# EAGLE design 130617_ReceiverSTM_0_0 (EAGLE 6.1)
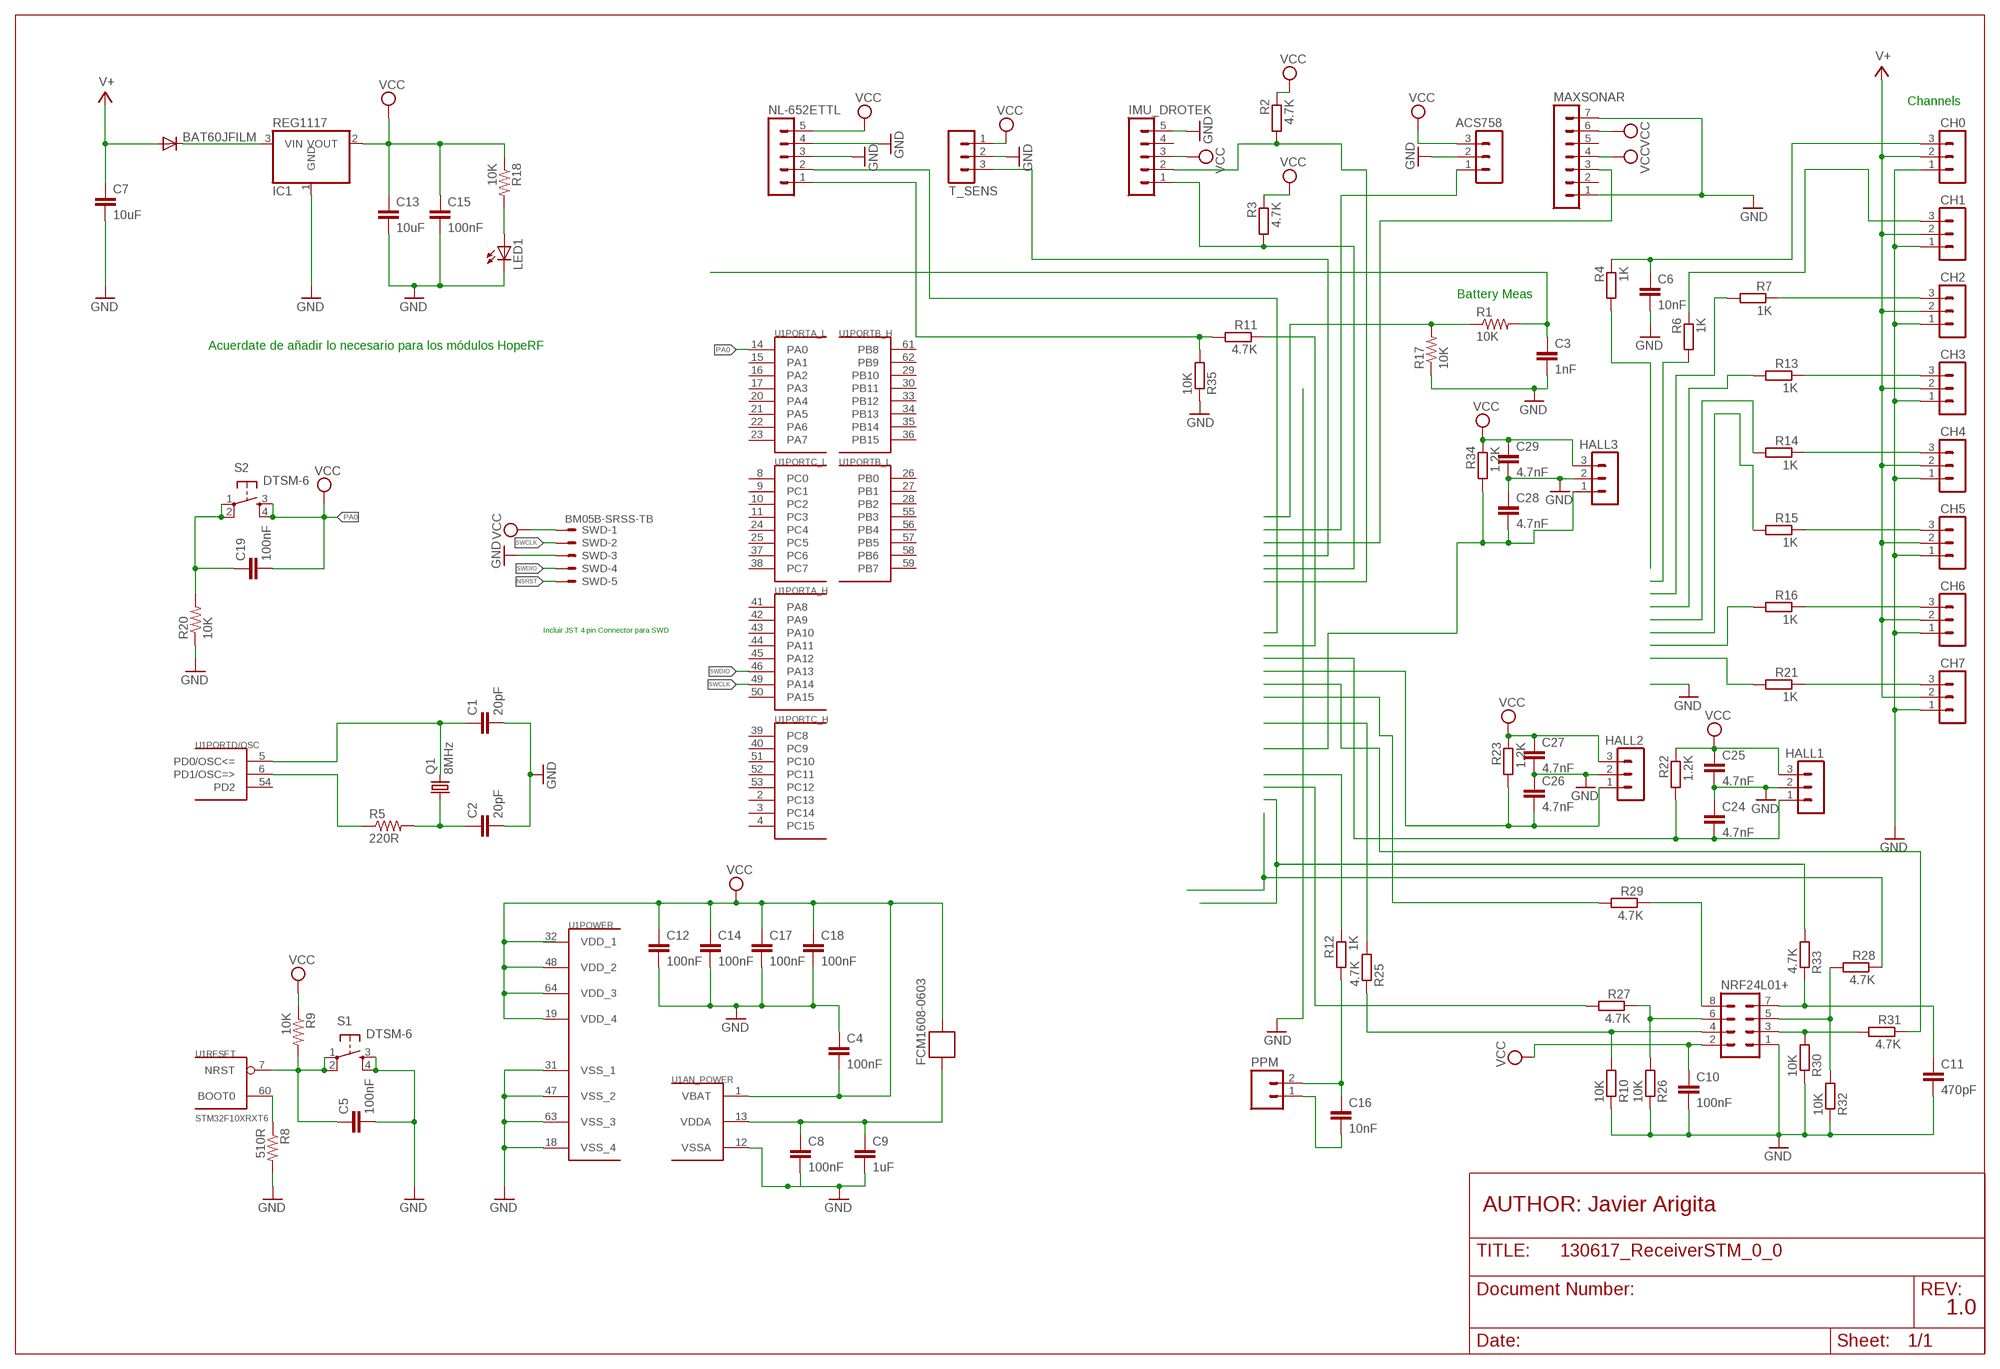
[diagram p0: schematic, sheet 1]

## Parts
ACS758  MA03-1  [MA03-1]
BAT60JFILM  DIODE-SOD323-R  [SOD323-R]
C1  20pF  C-EUC0805  [C0805]
C2  20pF  C-EUC0805  [C0805]
C3  1nF  C-EUC0805  [C0805]
C4  100nF  C-EUC0805  [C0805]
C5  100nF  C-EUC0805  [C0805]
C6  10nF  C-EU025-030X050  [C025-030X050]
C7  10uF  C-EUC3216  [C3216]
C8  100nF  C-EUC0805  [C0805]
C9  1uF  C-EUC3216  [C3216]
C10  100nF  C-EUC0805  [C0805]
C11  470pF  C-EU025-030X050  [C025-030X050]
C12  100nF  C-EUC0805  [C0805]
C13  10uF  C-EUC3216  [C3216]
C14  100nF  C-EUC0805  [C0805]
C15  100nF  C-EUC0805  [C0805]
C16  10nF  C-EU025-030X050  [C025-030X050]
C17  100nF  C-EUC0805  [C0805]
C18  100nF  C-EUC0805  [C0805]
C19  100nF  C-EUC0805  [C0805]
C24  4.7nF  C-EU025-030X050  [C025-030X050]
C25  4.7nF  C-EU025-030X050  [C025-030X050]
C26  4.7nF  C-EU025-030X050  [C025-030X050]
C27  4.7nF  C-EU025-030X050  [C025-030X050]
C28  4.7nF  C-EU025-030X050  [C025-030X050]
C29  4.7nF  C-EU025-030X050  [C025-030X050]
CH0  MA03-1  [MA03-1]
CH1  MA03-1  [MA03-1]
CH2  MA03-1  [MA03-1]
CH3  MA03-1  [MA03-1]
CH4  MA03-1  [MA03-1]
CH5  MA03-1  [MA03-1]
CH6  MA03-1  [MA03-1]
CH7  MA03-1  [MA03-1]
FCM1608-0603  FERRITE-BEAD  [R0603]
HALL1  MA03-1  [MA03-1]
HALL2  MA03-1  [MA03-1]
HALL3  MA03-1  [MA03-1]
IC1  REG1117  [SOT223]
IMU_DROTEK  MA05-1  [MA05-1]
LED1  LED0805  [CHIPLED_0805]
MAXSONAR  MA07-1  [MA07-1]
NL-652ETTL  MA05-1  [MA05-1]
NRF24L01+  MA04-2  [MA04-2]
PPM  M02  [02P]
Q1  8MHz  CRYSTALSM49  [SM49]
R1  10K  RESISTOR0805  [R0805]
R2  4.7K  R-EU_0204/7  [0204/7]
R3  4.7K  R-EU_0204/7  [0204/7]
R4  1K  R-EU_0204/7  [0204/7]
R5  220R  RESISTOR0805  [R0805]
R6  1K  R-EU_0204/7  [0204/7]
R7  1K  R-EU_0204/7  [0204/7]
R8  510R  RESISTOR0805  [R0805]
R9  10K  RESISTOR0805  [R0805]
R10  10K  R-EU_0204/7  [0204/7]
R11  4.7K  R-EU_0204/7  [0204/7]
R12  1K  R-EU_0204/7  [0204/7]
R13  1K  R-EU_0204/7  [0204/7]
R14  1K  R-EU_0204/7  [0204/7]
R15  1K  R-EU_0204/7  [0204/7]
R16  1K  R-EU_0204/7  [0204/7]
R17  10K  RESISTOR0805  [R0805]
R18  10K  RESISTOR0805  [R0805]
R20  10K  RESISTOR0805  [R0805]
R21  1K  R-EU_0204/7  [0204/7]
R22  1.2K  R-EU_0204/7  [0204/7]
R23  1.2K  R-EU_0204/7  [0204/7]
R25  4.7K  R-EU_0204/7  [0204/7]
R26  10K  R-EU_0204/7  [0204/7]
R27  4.7K  R-EU_0204/7  [0204/7]
R28  4.7K  R-EU_0204/7  [0204/7]
R29  4.7K  R-EU_0204/7  [0204/7]
R30  10K  R-EU_0204/7  [0204/7]
R31  4.7K  R-EU_0204/7  [0204/7]
R32  10K  R-EU_0204/7  [0204/7]
R33  4.7K  R-EU_0204/7  [0204/7]
R34  1.2K  R-EU_0204/7  [0204/7]
R35  10K  R-EU_0204/7  [0204/7]
S1  DTSM-6  [DTSM-6]
S2  DTSM-6  [DTSM-6]
SWD  BM05B-SRSS-TB  [BM05B-SRSS-TB]
T_SENS  MA03-1  [MA03-1]
U1  STM32F10XRXT6  [TQFP64]

## Nets
GND: ACS758.2 C1.2 C2.2 C3.2 C4.1 C5.2 C6.2 C7.2 C8.2 C9.2 C10.2 C11.2 C12.2 C13.2 C14.2 C15.2 C17.2 C18.2 C24.1 C25.2 C26.1 C27.2 C28.1 C29.2 CH0.1 CH1.1 CH2.1 CH3.1 CH4.1 CH5.1 CH6.1 CH7.1 HALL1.2 HALL2.2 HALL3.2 IC1.1(GND) IMU_DROTEK.5 LED1.C MAXSONAR.1 MAXSONAR.7 NL-652ETTL.3 NL-652ETTL.4 NRF24L01+.1 R8.2 R10.1 R17.1 R20.1 R26.1 R30.1 R32.1 R35.1 S1.3 S1.4 T_SENS.2 U1.12(AN_POWER:VSSA) U1.18(POWER:VSS_4) U1.31(POWER:VSS_1) U1.47(POWER:VSS_2) U1.63(POWER:VSS_3)
MAX_BRIDGE: NL-652ETTL.2
N$1: C1.1 Q1.2 U1.5(PORTD/OSC:PD0/OSC<=)
N$2: R5.1 U1.6(PORTD/OSC:PD1/OSC=>)
N$3: C2.1 Q1.1 R5.2
N$4: R8.1 U1.60(RESET:BOOT0)
N$5: C19.1 R20.2 S2.1 S2.2
N$6: ACS758.3 C25.1 C27.1 C29.1 HALL1.3 HALL2.3 HALL3.3 IMU_DROTEK.3 MAXSONAR.4 MAXSONAR.6 NL-652ETTL.5 R2.1 R3.1 R22.1 R23.1 R34.1 T_SENS.1 ; supply symbol labelled VCC
N$7: C16.2 PPM.1
N$8: IMU_DROTEK.2 R2.2
N$9: C5.1 R9.2 S1.1 S1.2 U1.7(RESET:NRST)
N$10: LED1.A R18.2
N$11: C28.2 HALL3.1 R34.2
N$12: R11.1
N$13: BAT60JFILM.C IC1.3(VIN)
N$14: C24.2 HALL1.1 R22.2
N$15: R12.1
N$16: C3.1 R1.2
N$17: C8.1 C9.1 FCM1608-0603.2 U1.13(AN_POWER:VDDA)
N$18: NRF24L01+.4 R10.2 R25.1
N$19: NRF24L01+.3 R30.2 R31.2
N$20: C16.1 PPM.2 R12.2
N$22: NL-652ETTL.1 R11.2 R35.2
N$25: T_SENS.3
N$26: R25.2
N$27: IMU_DROTEK.1 R3.2
N$28: ACS758.1
N$29: MAXSONAR.3
N$30: C26.2 HALL2.1 R23.2
N$33: R1.1 R17.2
N$37: R28.1
N$40: R33.2
N$41: R27.2
N$42: NRF24L01+.8 R29.1
N$43: NRF24L01+.6 R26.2 R27.1
N$46: R31.1
N$47: NRF24L01+.5 R28.2 R32.2
N$49: C11.1 NRF24L01+.7 R33.1
N$50: C6.1 CH0.3 R4.1
N$51: R4.2
N$52: R6.2
N$53: CH1.3 R6.1
N$54: CH2.3 R7.1
N$55: R7.2
N$56: CH3.3 R13.1
N$57: R13.2
N$58: CH4.3 R14.1
N$59: R14.2
N$60: CH5.3 R15.1
N$61: R15.2
N$62: CH6.3 R16.1
N$63: R16.2
N$64: CH7.3 R21.1
N$65: R21.2
N$66: R29.2
NSRST: SWD.5
PA0: C4.2 C10.1 C12.1 C13.1 C14.1 C15.1 C17.1 C18.1 C19.2 FCM1608-0603.1 IC1.2(VOUT) NRF24L01+.2 R9.1 R18.1 S2.3 S2.4 U1.1(AN_POWER:VBAT) U1.14(PORTA_L:PA0) U1.19(POWER:VDD_4) U1.48(POWER:VDD_2) U1.64(POWER:VDD_3) ; supply symbol labelled VCC
SWCLK: SWD.2 SWD.3 U1.49(PORTA_H:PA14) ; supply symbol labelled GND
SWDIO: SWD.4 U1.46(PORTA_H:PA13)
V+: BAT60JFILM.A C7.1 CH0.2 CH1.2 CH2.2 CH3.2 CH4.2 CH5.2 CH6.2 CH7.2
VCC: SWD.1
Unconnected: IMU_DROTEK.4 MAXSONAR.2 MAXSONAR.5 U1.2(PORTC_H:PC13) U1.3(PORTC_H:PC14) U1.4(PORTC_H:PC15) U1.8(PORTC_L:PC0) U1.9(PORTC_L:PC1) U1.10(PORTC_L:PC2) U1.11(PORTC_L:PC3) U1.15(PORTA_L:PA1) U1.16(PORTA_L:PA2) U1.17(PORTA_L:PA3) U1.20(PORTA_L:PA4) U1.21(PORTA_L:PA5) U1.22(PORTA_L:PA6) U1.23(PORTA_L:PA7) U1.24(PORTC_L:PC4) U1.25(PORTC_L:PC5) U1.26(PORTB_L:PB0) U1.27(PORTB_L:PB1) U1.28(PORTB_L:PB2) U1.29(PORTB_H:PB10) U1.30(PORTB_H:PB11) U1.33(PORTB_H:PB12) U1.34(PORTB_H:PB13) U1.35(PORTB_H:PB14) U1.36(PORTB_H:PB15) U1.37(PORTC_L:PC6) U1.38(PORTC_L:PC7) U1.39(PORTC_H:PC8) U1.40(PORTC_H:PC9) U1.41(PORTA_H:PA8) U1.42(PORTA_H:PA9) U1.43(PORTA_H:PA10) U1.44(PORTA_H:PA11) U1.45(PORTA_H:PA12) U1.50(PORTA_H:PA15) U1.51(PORTC_H:PC10) U1.52(PORTC_H:PC11) U1.53(PORTC_H:PC12) U1.54(PORTD/OSC:PD2) U1.55(PORTB_L:PB3) U1.56(PORTB_L:PB4) U1.57(PORTB_L:PB5) U1.58(PORTB_L:PB6) U1.59(PORTB_L:PB7) U1.61(PORTB_H:PB8) U1.62(PORTB_H:PB9)

## Notes on the sheet
- Channels
- Battery Meas
- Acuerdate de añadir lo necesario para los módulos HopeRF
- Incluir JST 4 pin Connector para SWD
- AUTHOR: Javier Arigita
- 1.0

## Power pins joined to a net without a drawn wire
VDD_1: U1.32(POWER:VDD_1)

## Library data of the parts
ACS758 CH0 CH1-CH7 HALL1-HALL3 T_SENS = con-lstb:MA03-1: PIN HEADER; OC_FARNELL: unknown; OC_NEWARK: unknown
BAT60JFILM = diode:DIODE-: DIODE
C1-C6 C8 C10-C12 C14-C19 C24-C29 = rcl:C-EU: CAPACITOR, European symbol
C7 C9 C13 = resistor:C-EU: CAPACITOR, European symbol
FCM1608-0603 = BaseApp:FERRITE-BEAD
IC1 = CEDT:REG1117: 800mA and 1A Low Dropout (LDO) Positive Regulator 1.8V, 2.5V, 2.85V, 3.3V, 5V, and Adj
IMU_DROTEK NL-652ETTL = con-lstb:MA05-1: PIN HEADER; OC_FARNELL: unknown; OC_NEWARK: unknown
LED1 = CEDT:LED
MAXSONAR = con-lstb:MA07-1: PIN HEADER; OC_FARNELL: unknown; OC_NEWARK: unknown
NRF24L01+ = con-lstb:MA04-2: PIN HEADER; OC_FARNELL: unknown; OC_NEWARK: unknown
PPM = con-amp-quick:M02: AMP QUICK CONNECTOR; OC_FARNELL: unknown; OC_NEWARK: unknown
Q1 = crystal:CRYSTAL: CRYSTAL; OC_FARNELL: unknown; OC_NEWARK: unknown
R1 R5 R8 R9 R17 R18 R20 = CEDT:RESISTOR
R2-R4 R6 R7 R10-R16 R21-R23 R25-R35 = rcl:R-EU_: RESISTOR, European symbol
S1 S2 = switch-tact:DTSM-6
SWD = con-jst2:?M05B-SRSS-TB: Disconnectable Crimp style connector, 1.0mm pitch 5 contacts
U1 = stm32:STM32F10XRXT6: STM32F101/103 64pin LQFP

## Board
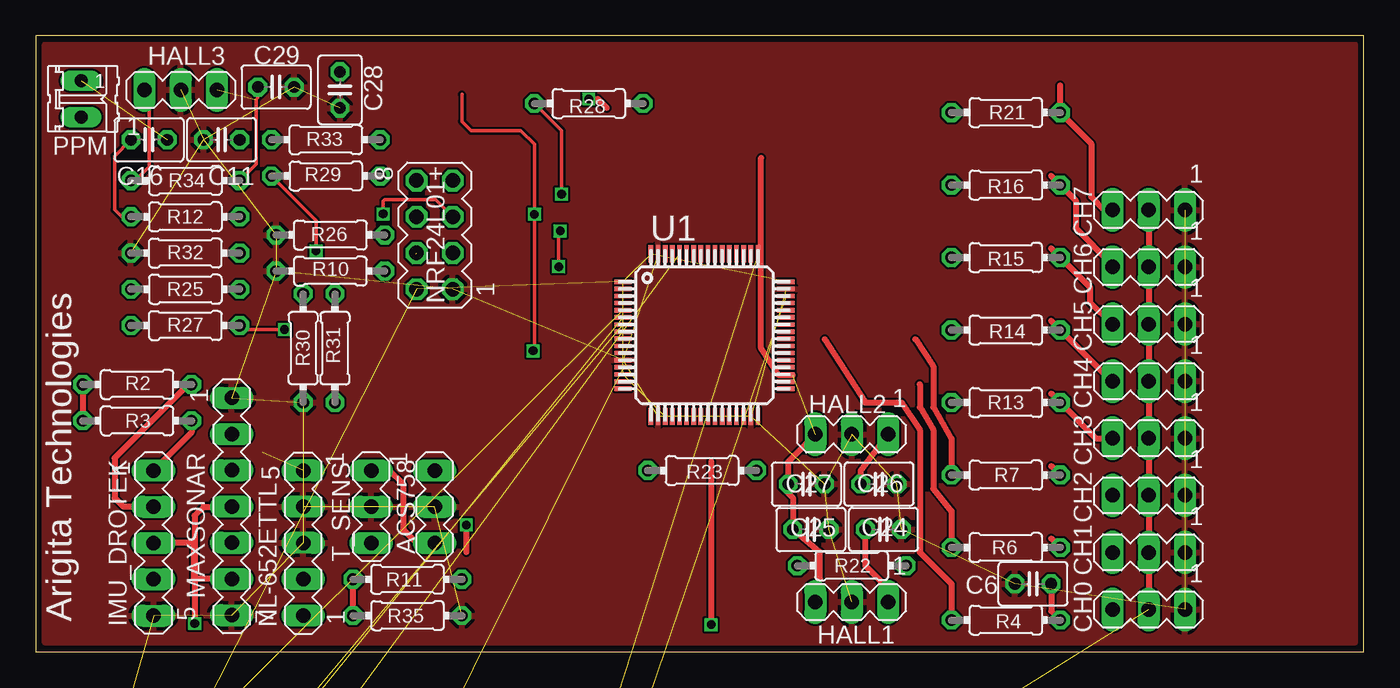
[diagram p1: board, top side]
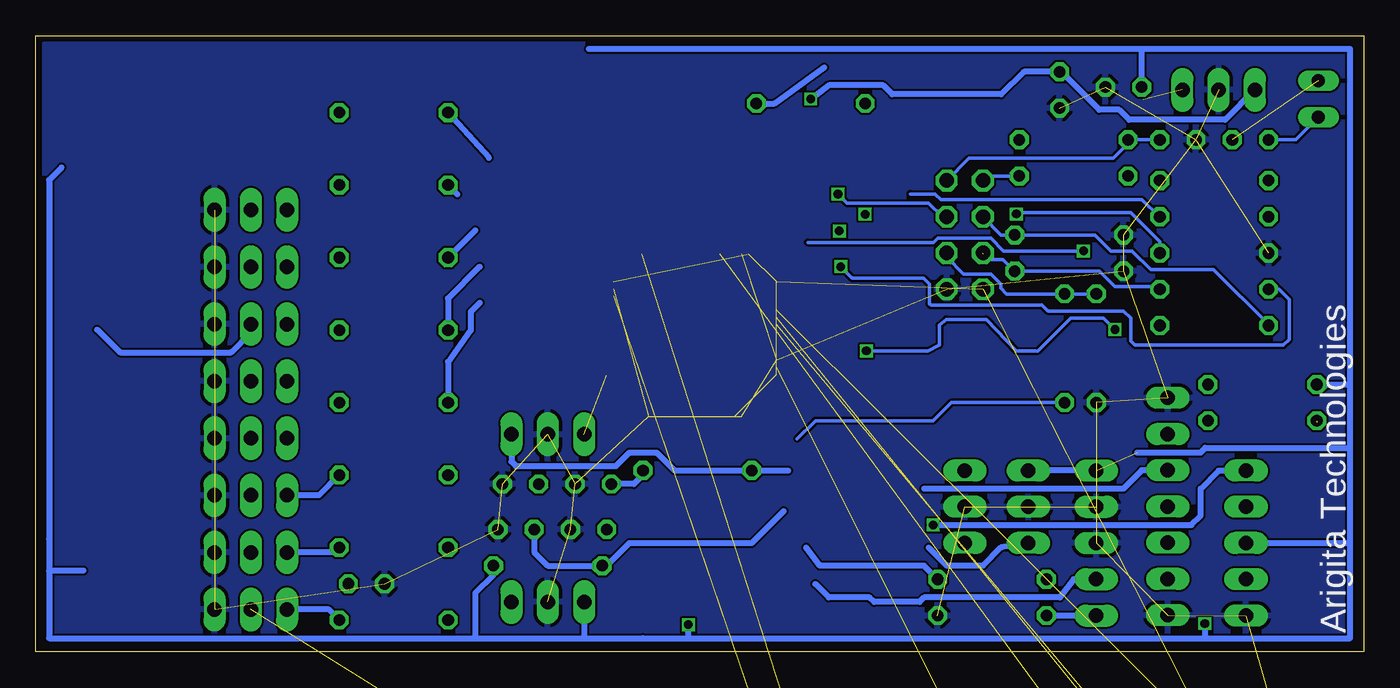
[diagram p2: board, bottom side, seen from below]

Size 93.02 x 43.17 mm. Coordinates in mm from the lower left corner, seen from the top.
Outline: 0,0 93.02,0 93.02,43.17 0,43.17 0,0
Copper layers (1*16): Top 0.035mm / dielectric 1.5mm / Bottom 0.035mm
Design rules: minimum track width 6mil, minimum drill 12mil, track to track 6mil, track to pad 6mil, pad to pad 6mil, via to via 6mil, smd to smd 0mil, copper to edge 10mil, drill to drill 10mil, minimum pad ring 10mil, minimum via ring 6mil, stop-mask expansion 2mil, vias tented up to drill 100mil, thermal gap 10mil

### Footprints (pad centres in the part's own frame; a part is rotated, then mirrored left to right if it is on the bottom)
MA03-1 = drill 1.016 long: 1 -2.54,0; 2 0,0; 3 2.54,0
SOD323-R = smd 0.6 x 0.6: A 1.1,0; C -1.1,0
C0805 = smd 1.3 x 1.5: 1 -0.95,0; 2 0.95,0
C025-030X050 = drill 0.813 octagon: 1 -1.27,0; 2 1.27,0
C3216 = smd 1.6 x 1.8: 1 -1.4,0; 2 1.4,0
R0603 = smd 1 x 1.1: 1 -0.85,0; 2 0.85,0
SOT223 = smd 1.499 x 2.007: 1 -2.261,-3.15; 2 0.025,-3.15; 3 2.311,-3.15 | smd 3.81 x 2.007: 4 0,3.15
MA05-1 = drill 1.016 long: 1 -5.08,0; 2 -2.54,0; 3 0,0; 4 2.54,0; 5 5.08,0
CHIPLED_0805 = smd 1.2 x 1.2: A 0,-1.05; C 0,1.05
MA07-1 = drill 1.016 long: 1 -7.62,0; 2 -5.08,0; 3 -2.54,0; 4 0,0; 5 2.54,0; 6 5.08,0; 7 7.62,0
MA04-2 = drill 1.016 octagon: 1 -3.81,-1.27; 2 -3.81,1.27; 3 -1.27,-1.27; 4 -1.27,1.27; 5 1.27,-1.27; 6 1.27,1.27; 7 3.81,-1.27; 8 3.81,1.27
02P = drill 0.914 long: 1 -1.27,0; 2 1.27,0
SM49 = smd 5.08 x 1.778: 1 -4.826,0; 2 4.826,0
R0805 = smd 1.3 x 1.5: 1 -0.95,0; 2 0.95,0
0204/7 = drill 0.813 octagon: 1 -3.81,0; 2 3.81,0
DTSM-6 = smd 1.55 x 1.3: 1 -3.975,2.25; 2 3.975,2.25; 3 -3.975,-2.25; 4 3.975,-2.25
BM05B-SRSS-TB = smd 0.6 x 1.55: 1 2,-1.625; 2 1,-1.625; 3 0,-1.625; 4 -1,-1.625; 5 -2,-1.625 | smd 1.2 x 1.8: FIT@1 3.3,0.9; FIT@2 -3.3,0.9
TQFP64 = smd 1.2 x 0.3: 1 -5.7,3.75; 2 -5.7,3.25; 3 -5.7,2.75; 4 -5.7,2.25; 5 -5.7,1.75; 6 -5.7,1.25; 7 -5.7,0.75; 8 -5.7,0.25; 9 -5.7,-0.25; 10 -5.7,-0.75; 11 -5.7,-1.25; 12 -5.7,-1.75; 13 -5.7,-2.25; 14 -5.7,-2.75; 15 -5.7,-3.25; 16 -5.7,-3.75; 33 5.7,-3.75; 34 5.7,-3.25; 35 5.7,-2.75; 36 5.7,-2.25; 37 5.7,-1.75; 38 5.7,-1.25; 39 5.7,-0.75; 40 5.7,-0.25; 41 5.7,0.25; 42 5.7,0.75; 43 5.7,1.25; 44 5.7,1.75; 45 5.7,2.25; 46 5.7,2.75; 47 5.7,3.25; 48 5.7,3.75 | smd 0.3 x 1.2: 17 -3.75,-5.7; 18 -3.25,-5.7; 19 -2.75,-5.7; 20 -2.25,-5.7; 21 -1.75,-5.7; 22 -1.25,-5.7; 23 -0.75,-5.7; 24 -0.25,-5.7; 25 0.25,-5.7; 26 0.75,-5.7; 27 1.25,-5.7; 28 1.75,-5.7; 29 2.25,-5.7; 30 2.75,-5.7; 31 3.25,-5.7; 32 3.75,-5.7; 49 3.75,5.7; 50 3.25,5.7; 51 2.75,5.7; 52 2.25,5.7; 53 1.75,5.7; 54 1.25,5.7; 55 0.75,5.7; 56 0.25,5.7; 57 -0.25,5.7; 58 -0.75,5.7; 59 -1.25,5.7; 60 -1.75,5.7; 61 -2.25,5.7; 62 -2.75,5.7; 63 -3.25,5.7; 64 -3.75,5.7

### Placement (x,y rotation side)
ACS758  27.94,10.16 270 top
BAT60JFILM  -16.07,-73.82 0 top  (outside the outline)
C1  2.03,-15.92 0 top  (outside the outline)
C2  2.03,-19.92 0 top  (outside the outline)
C3  -15.77,-90.02 0 top  (outside the outline)
C4  -21.77,-141.82 0 top  (outside the outline)
C5  -7.77,-38.22 0 top  (outside the outline)
C6  69.85,4.76 180 top
C7  -15.27,-56.02 0 top  (outside the outline)
C8  -15.77,-96.12 0 top  (outside the outline)
C9  -15.27,-102.02 0 top  (outside the outline)
C10  -15.77,-68.02 0 top  (outside the outline)
C11  13.02,35.88 180 top
C12  -15.77,-111.32 0 top  (outside the outline)
C13  -15.27,-50.22 0 top  (outside the outline)
C14  -15.77,-117.42 0 top  (outside the outline)
C15  -15.77,-61.92 0 top  (outside the outline)
C16  7.94,35.88 0 top
C17  -15.77,-123.52 0 top  (outside the outline)
C18  -15.77,-129.62 0 top  (outside the outline)
C19  -21.77,-168.02 0 top  (outside the outline)
C24  59.37,8.57 180 top
C25  54.29,8.57 0 top
C26  59.05,11.75 180 top
C27  53.97,11.75 0 top
C28  21.31,39.37 90 top
C29  16.83,39.57 0 top
CH0  77.95,2.96 180 top
CH1  77.95,6.96 180 top
CH2  77.95,10.96 180 top
CH3  77.95,14.96 180 top
CH4  77.95,18.96 180 top
CH5  77.95,22.96 180 top
CH6  77.95,26.96 180 top
CH7  77.95,30.96 180 top
FCM1608-0603  -15.97,-107.32 0 top  (outside the outline)
HALL1  57.15,3.49 180 top
HALL2  57.15,15.24 180 top
HALL3  10.16,39.37 0 top
IC1  -14.47,-40.92 0 top  (outside the outline)
IMU_DROTEK  8.25,7.62 270 top
LED1  -20.87,-130.82 0 top  (outside the outline)
MAXSONAR  13.73,10.18 270 top
NL-652ETTL  18.73,7.62 90 top
NRF24L01+  27.94,29.21 90 top
PPM  3.17,38.73 270 top
Q1  -16.37,-149.32 0 top  (outside the outline)
R1  -15.77,-77.82 0 top  (outside the outline)
R2  7.1,18.73 0 top
R3  7.1,16.19 0 top
R4  67.94,2.22 180 top
R5  2.03,-26.02 0 top  (outside the outline)
R6  67.94,7.3 180 top
R7  67.94,12.38 180 top
R8  2.03,-32.12 0 top  (outside the outline)
R9  -7.77,-44.32 0 top  (outside the outline)
R10  20.64,26.67 0 top
R11  26.04,5.08 180 top
R12  10.48,30.48 180 top
R13  67.94,17.46 180 top
R14  67.94,22.54 180 top
R15  67.94,27.62 180 top
R16  67.94,32.7 180 top
R17  -15.77,-83.92 0 top  (outside the outline)
R18  -21.77,-135.72 0 top  (outside the outline)
R20  -21.77,-174.12 0 top  (outside the outline)
R21  67.94,37.78 180 top
R22  57.15,6.03 180 top
R23  46.67,12.7 180 top
R25  10.48,25.4 180 top
R26  20.64,29.21 0 top
R27  10.48,22.86 0 top
R28  38.73,38.42 180 top
R29  20.32,33.34 180 top
R30  18.73,21.27 90 top
R31  20.95,21.27 90 top
R32  10.48,27.94 0 top
R33  20.32,35.88 0 top
R34  10.48,33.02 180 top
R35  26.04,2.54 180 top
S1  -4.97,-29.52 0 top  (outside the outline)
S2  -18.97,-159.42 0 top  (outside the outline)
SWD  -16.97,-179.62 0 top  (outside the outline)
T_SENS  23.5,10.16 270 top
U1  46.83,22.18 0 top

### Tracks (layer width: path | path; a pad name or v marks a point on that pad's centre or on a via)
GND  (58 unrouted)
  pour Top: 0.63,42.54 92.39,42.54 92.39,0.64 0.63,0.64
  pour Bottom: 0.63,42.54 92.39,42.54 92.39,0.64 0.63,0.64
MAX_BRIDGE
  Bottom 0.406: NL-652ETTL.2 20.32,5.08 21.27,3.81 30.8,3.81 31.11,3.49 34.29,3.49 34.61,3.81 37.47,3.81 38.42,4.76
N$1  (2 unrouted)
N$2  (1 unrouted)
N$3  (2 unrouted)
N$4  (1 unrouted)
N$5  (3 unrouted)
N$6  (via drill 0.6)  (4 unrouted)
  Top 0.254: R34.1 15.43,34.17 15.43,38.68 15.56,38.81 C29.1
  Top 0.406: 53.02,19.37 52.07,19.37 50.8,21.27 50.8,34.61 | HALL1.3 54.61,4.76 54.93,5.08 54.93,6.99 C25.1 53.02,10.8 52.71,11.11 C27.1 52.71,13.33 HALL2.3 | T_SENS.1 24.77,12.7 25.72,11.75 25.72,8.57 26.67,7.62 ACS758.3 | 47.31,13.33 v47.31,1.91 | MAXSONAR.4 13.73,10.16 11.75,10.16 11.11,9.52 11.13,9.52 v11.13,1.98 | MAXSONAR.6 11.11,5.1 11.11,7.62 IMU_DROTEK.3 | R2.1 3.29,16.08 3.33,16.08
  Bottom 0.406: 92.08,5.68 92.08,7.94 92.08,33.06 91.21,33.92 | 92.08,5.68 92.08,0.95 62.23,0.95 | 62.23,0.95 54.61,0.95 | 54.61,0.95 50.48,0.95 47.31,0.95 | 47.31,0.95 11.13,0.95 | 11.13,0.95 0.95,0.95 0.95,7.62 | 0.95,7.62 0.95,14.29 | 0.95,14.29 0.95,18.68 | 0.95,18.68 0.95,42.23 15.56,42.23 | 15.56,42.23 26.04,42.23 54.29,42.23 | 89.68,5.68 92.08,5.68 | 0.95,14.29 11.11,14.29 11.43,13.97 15.88,13.97 | HALL1.3 54.61,0.95 | R22.1 60.96,5.4 62.23,4.13 62.23,0.95 | R23.1 50.48,12.38 51.12,11.75 C27.1 | 47.31,0.95 v47.31,1.91 | NL-652ETTL.5 T_SENS.1 | IMU_DROTEK.3 0.95,7.62 | C29.1 15.56,42.23 | R2.1 1,18.73 0.95,18.68 | v11.13,1.98 11.13,0.95
N$7  (1 unrouted)
N$8
  Top 0.406: R2.2 10.68,18.73 5.53,13.58 5.53,10.78 6.13,10.18 8.23,10.18 IMU_DROTEK.2
N$9  (4 unrouted)
N$10  (1 unrouted)
N$11  (via drill 0.6)
  Top 0.254: HALL3.1 7.93,39.06 7.93,33.98 6.97,33.02 R34.2
  Top 0.406: v38.74,38.74 39.37,38.74 40,38.1
  Bottom 0.406: v38.74,38.74 37.47,39.69 33.65,39.69 33.02,39.05 25.4,39.05 23.81,40.64 C28.2 21.19,40.64 18.53,37.98 17.13,37.98 16.43,37.28 9.71,37.28 HALL3.1
N$12
  Bottom 0.406: R11.1 30.8,6.03 38.1,6.03 39.05,7.3
N$13  (1 unrouted)
N$14
  Top 0.406: HALL1.1 59.69,4.45 58.1,6.03 C24.2
  Bottom 0.406: C24.2 58.1,6.99 57.15,6.03 R22.2 53.02,6.03 51.43,7.62 42.86,7.62 40.64,9.84
N$15
  Bottom 0.254: 31.76,32.08 30.03,32.08 29.63,31.68 15.53,31.68 14.33,30.48 R12.1
N$16  (1 unrouted)
N$17  (3 unrouted)
N$18  (1 unrouted)
  Bottom 0.254: 26.63,27.88 26.43,27.88 26.03,27.48 25.26,27.48 R10.2 18.52,26.67 17.43,25.58 14.47,25.58 R25.1
N$19
  Bottom 0.254: R30.2 R31.2 25.03,25.08 25.43,25.48 25.43,25.78 26.13,26.48 28.03,26.48 29.21,27.66 NRF24L01+.3
N$20
  Top 0.254: C16.1 5.53,34.74 5.53,30.98 6.04,30.48 R12.2
  Bottom 0.254: PPM.2 4.76,35.88 C16.1
N$22
  Top 0.406: R35.2 R11.2
  Bottom 0.406: NL-652ETTL.1 R35.2
N$25
  Bottom 0.406: T_SENS.3 25.4,7.3 26.67,6.03 29.21,6.03 30.48,7.3
N$26  (via drill 0.6)
  Top 0.254: v36.73,29.48 36.63,29.38 v36.63,26.98
  Bottom 0.254: 36.79,29.48 v36.73,29.48 | v36.63,26.98 35.83,26.18 30.83,26.18 30.43,25.78 30.43,24.38 30.33,24.28 22.53,24.28 22.13,23.88 16.83,23.88 16.33,23.38 16.33,21.78 16.03,21.48 5.63,21.48 5.23,21.88 5.23,24.68 5.95,25.4 R25.2
N$27  (via drill 0.6)
  Top 0.406: 30.16,6.99 v30.16,8.89 | R3.2 10.91,15.36 IMU_DROTEK.1
  Bottom 0.406: v30.16,8.89 12.07,8.89 11.43,9.52 11.43,11.43 10.16,12.7 IMU_DROTEK.1
N$29
  Bottom 0.406: 30.8,11.43 16.83,11.43 15.56,12.7 15.56,12.72 MAXSONAR.3
N$30
  Top 0.406: C26.2 57.79,12.7 HALL2.1
  Bottom 0.406: HALL2.1 59.69,13.33 59.37,13.02 52.39,13.02 51.43,13.97 49.53,13.97 48.26,12.7 R23.2 40.32,12.7
N$33  (1 unrouted)
N$37
  Bottom 0.406: R28.1 41.28,38.42 37.78,40.96
N$41  (via drill 0.6)
  Top 0.254: 29.85,39.05 29.85,37.15 30.48,36.51 33.97,36.51 34.93,35.56 v34.93,30.66 34.93,21.17 v34.83,21.08 | R27.2 14.57,22.58 v17.43,22.58
  Bottom 0.254: v17.43,22.58 18.23,23.38 20.53,23.38 22.83,21.08 24.33,21.08 26.43,23.28 29.23,23.28 29.73,22.88 29.73,21.48 30.53,21.08 v34.83,21.08
N$42
  Bottom 0.254: NRF24L01+.8 26.35,33.34 R29.1
N$43
  Bottom 0.254: NRF24L01+.6 25.4,29.21 R26.2 24.42,29.18 18.83,29.18 17.73,28.08 16.23,28.08 14.93,26.78 10.53,26.78 6.67,22.92 R27.1
N$46
  Bottom 0.254: R31.1 28.89,17.46 30.16,16.19 38.42,16.19 39.69,14.92
N$47  (via drill 0.6)
  Top 0.254: R28.2 36.83,36.51 v36.83,32.07 | NRF24L01+.5 28.01,31.68 24.43,31.68 24.33,31.58 v24.33,30.68
  Bottom 0.254: 29.53,30.48 30.48,31.43 36.19,31.43 v36.83,32.07 | v24.33,30.68 24.23,30.78 16.33,30.78 14.29,28.74 R32.2
  Bottom 0.406: 29.53,30.48 NRF24L01+.5
N$49
  Bottom 0.254: NRF24L01+.7 27.65,34.58 17.53,34.58 16.51,35.6 R33.1 C11.1
N$50
  Top 0.406: C6.1 71.12,2.86 R4.1
  Bottom 0.406: R4.1 72.49,2.96 CH0.3
N$51
  Top 0.406: 55.25,21.91 58.1,17.46 60.64,17.46 61.91,15.56 61.91,6.99 64.13,4.76 R4.2
N$52
  Top 0.406: 61.91,18.73 61.91,17.14 62.86,15.56 62.86,11.43 64.13,9.84 R6.2
N$53
  Top 0.406: 71.12,7.94 R6.1
  Bottom 0.406: R6.1 72.1,6.96 CH1.3
N$54
  Top 0.406: 71.12,13.02 R7.1
  Bottom 0.406: R7.1 73.18,10.96 CH2.3
N$55
  Top 0.406: 61.6,21.91 62.86,20 62.86,17.14 64.13,14.92 R7.2
N$56
  Top 0.406: 71.12,18.1 R13.1 74.25,14.96 CH3.3
N$57
  Bottom 0.406: 61.91,24.45 62.55,23.81 62.55,22.54 64.13,20.32 R13.2
N$58
  Top 0.406: 71.12,23.18 R14.1 75.33,18.96 CH4.3
N$59
  Bottom 0.406: 61.91,26.99 64.13,24.76 R14.2
N$60
  Top 0.406: 71.12,28.26 R15.1 73.83,25.55 73.83,24.48 75.35,22.96 CH5.3
N$61
  Bottom 0.406: 62.23,29.53 R15.2
N$62
  Top 0.406: 71.12,33.34 R16.1 72.83,31.62 72.83,29.68 75.41,27.11 CH6.3
N$63
  Bottom 0.406: 63.5,32.07 R16.2
N$64
  Top 0.406: 71.75,39.69 R21.1 73.93,35.6 73.93,31.88 74.85,30.96 CH7.3
N$65
  Bottom 0.406: 61.28,34.61 R21.2
N$66  (via drill 0.6)
  Top 0.254: R29.2 19.63,30.21 v19.63,28.08
  Bottom 0.254: 38.94,28.68 30.13,28.68 29.83,28.98 26.13,28.98 25.23,28.08 v19.63,28.08 19.53,28.08
PA0  (20 unrouted)
SWCLK  (2 unrouted)
SWDIO  (1 unrouted)
V+  (2 unrouted)
  Top 0.406: CH7.2 CH6.2 CH5.2 CH4.2 CH3.2 CH2.2 CH1.2 CH0.2
  Bottom 0.406: CH5.2 77.95,22.37 79.33,20.98 87.11,20.98 88.71,22.58

### Text on the board
tPlace: Arigita Technologies
bPlace: Arigita Technologies